# EasyEDA Pro project 25集创赛海云捷讯杯.epro, board PCB1_1
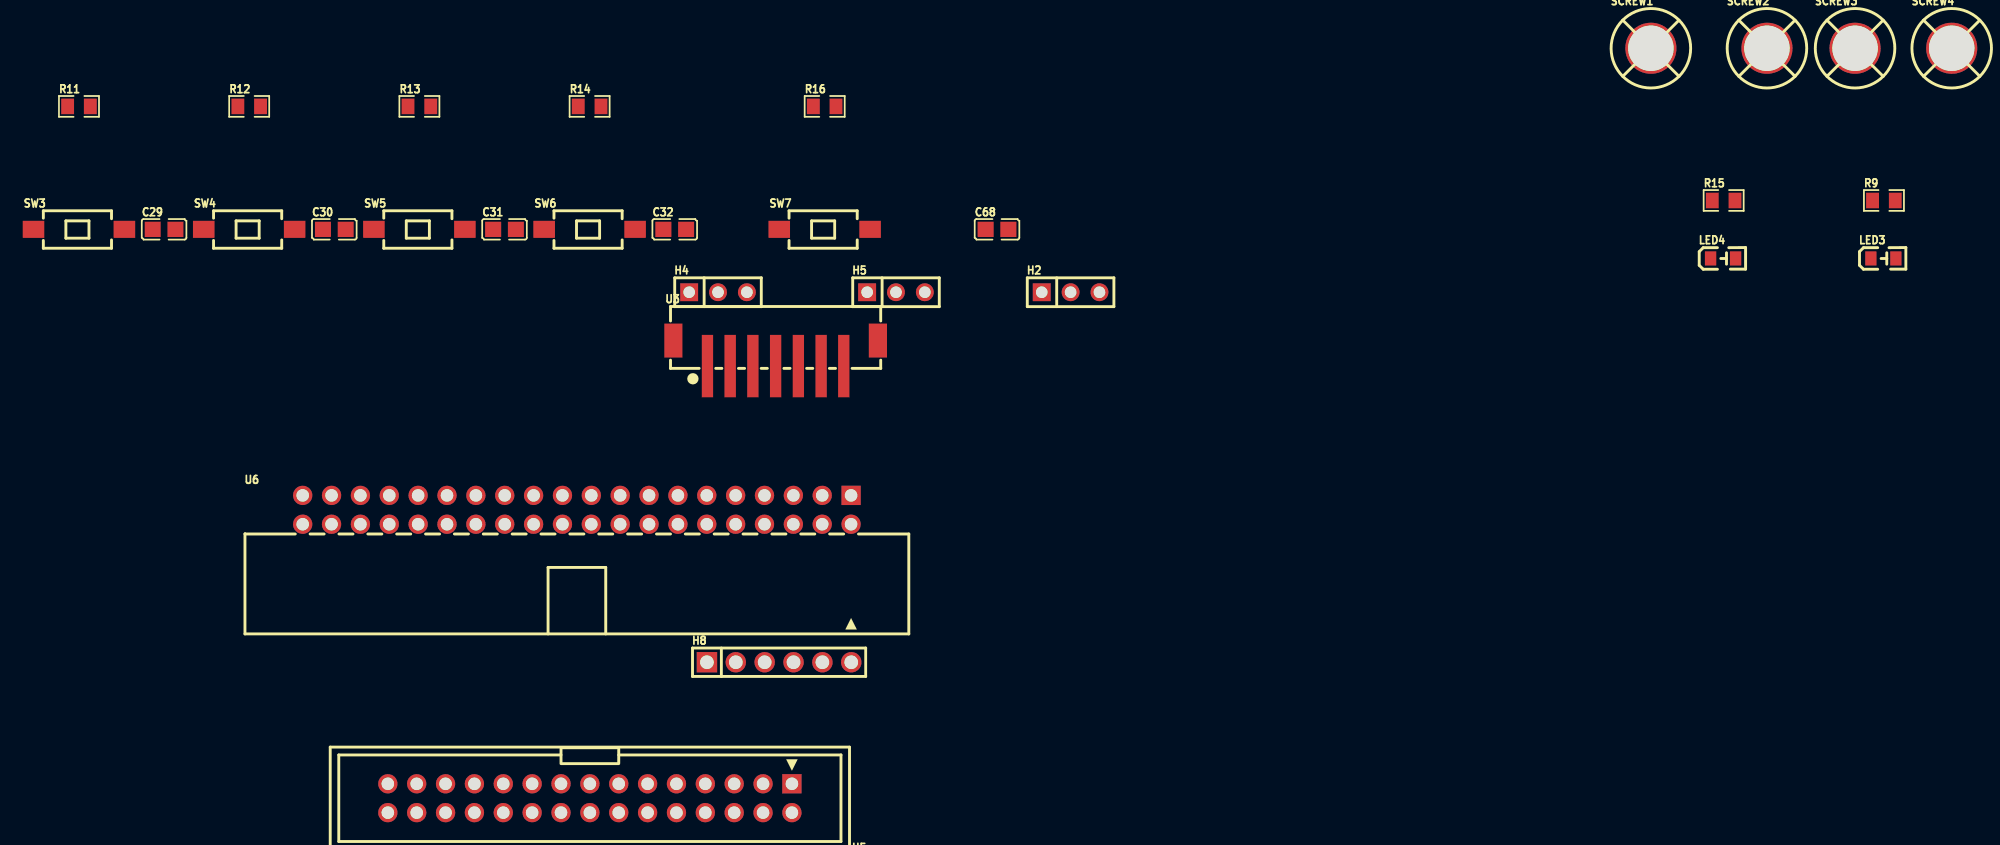
[diagram p10: board, top side]
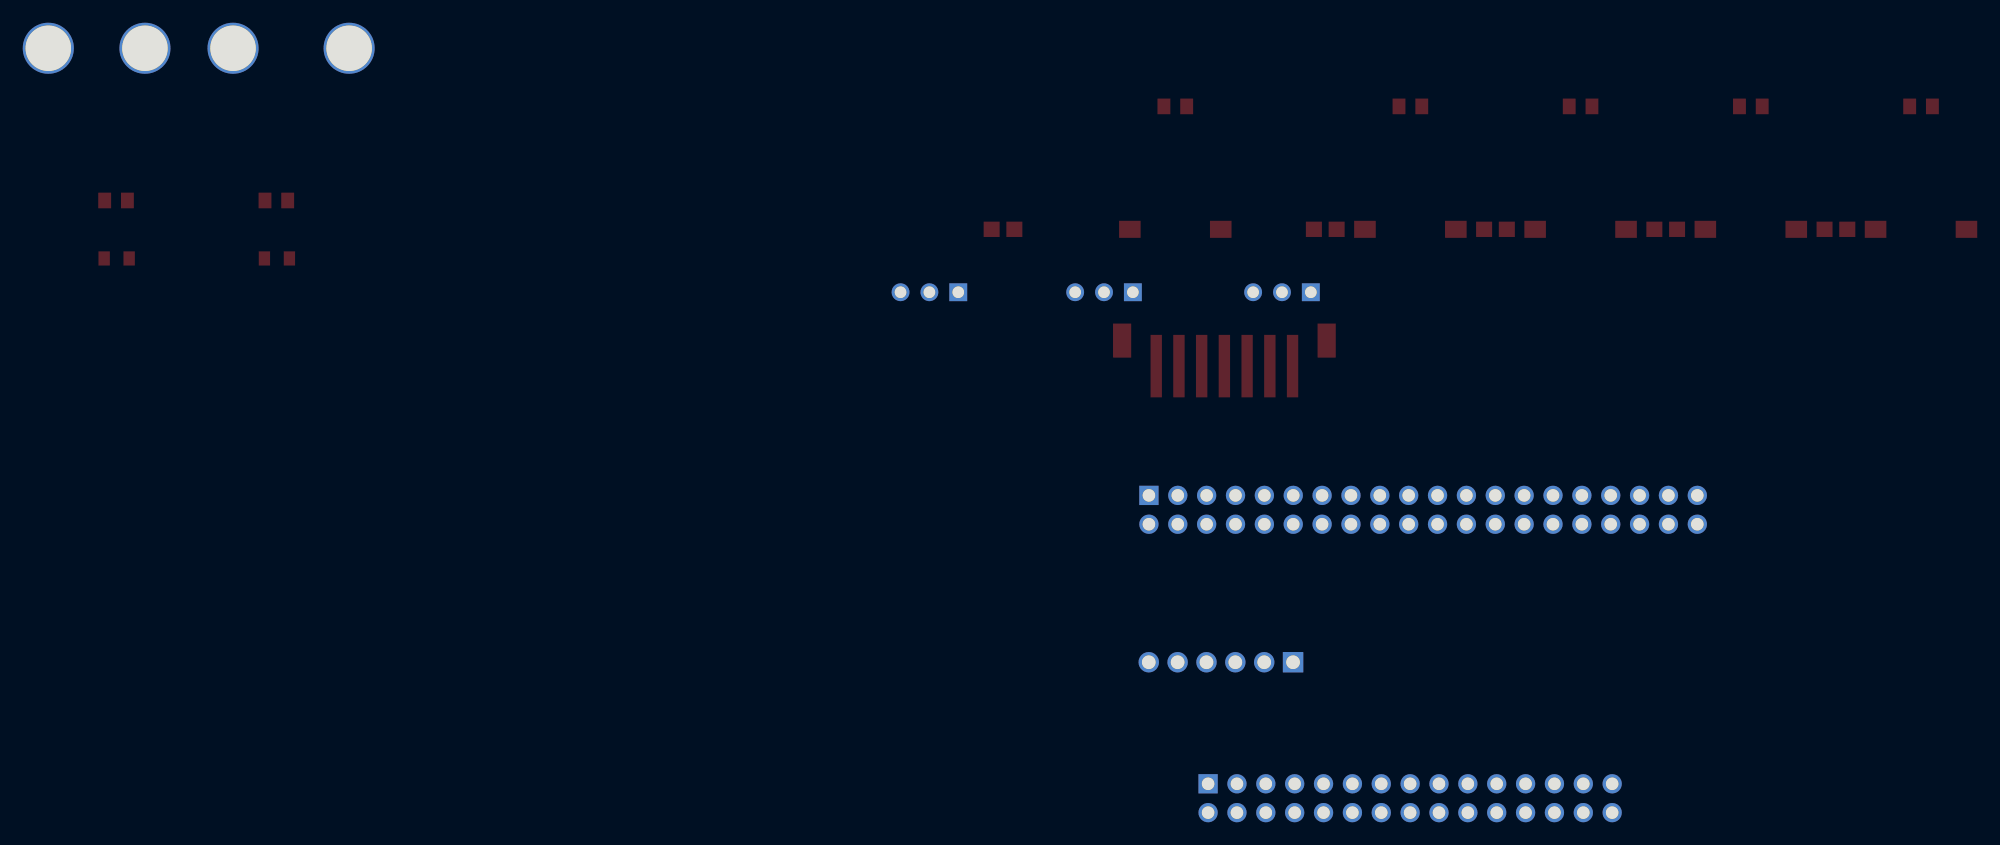
[diagram p11: board, bottom side, seen from below]

No outline. copper layers: Top Layer, Bottom Layer. Coordinates in mm from the lowest, leftmost part position.
Stack: Top Layer 0.035mm / Dielectric1 1.51mm FR4 er 4.5 / Bottom Layer 0.035mm

## Design rules (mm)
spacing copperThickness1oz (default): track to track 0.102, other pairs 0.152 to 0.3
spacing copperThickness2oz: track to track 0.203, other pairs 0.152 to 0.3
spacing Plane_innerPlane: track to track 0.102, other pairs 0.152 to 0.3
spacing Copper_copperRegion: track to track 0.102, other pairs 0.152 to 0.3
track width copperThickness1oz (default): min 0.127, default 0.254, max 2.54
track width copperThickness2oz: min 0.203, default 0.254, max 2.54
differential pair differentialPair (default): width min 0.127, default 0.254, max 2.54; gap min 0.152, default 0.152

## Placement (name value [footprint] x y rotation side)
C29  104  [c0805]  7.49 50.1 0 top
C30  104  [c0805]  22.47 50.1 0 top
C31  104  [c0805]  37.45 50.1 0 top
C32  104  [c0805]  52.43 50.1 0 top
C68  104  [c0805]  80.79 50.1 0 top
H2  -  [HDR-TH_3P-P2.54-V-F]  87.27 44.56 0 top
H4  -  [HDR-TH_3P-P2.54-V-F]  56.24 44.56 0 top
H5  -  [HDR-TH_3P-P2.54-V-F]  71.9 44.56 0 top
H8  -  [HDR-TH_6P-P2.54-V-M-1]  61.61 11.98 0 top
LED3  -  [LED_0805]  158.84 47.53 0 top
LED4  -  [LED_0805]  144.74 47.53 0 top
R9  10K  [R0805]  158.84 52.64 0 top
R11  10K  [R0805]  0 60.93 0 top
R12  10K  [R0805]  14.98 60.93 0 top
R13  10K  [R0805]  29.96 60.93 0 top
R14  10K  [R0805]  44.94 60.93 0 top
R15  10K  [R0805]  144.74 52.64 0 top
R16  10K  [R0805]  65.63 60.93 0 top
SCREW1  -  [M4螺丝]  138.33 66.05 0 top
SCREW2  -  [M4螺丝]  148.55 66.05 0 top
SCREW3  -  [M4螺丝]  156.3 66.05 0 top
SCREW4  -  [M4螺丝]  164.81 66.05 0 top
SW3  TS-1101-C-W  [SW-SMD_L6.0-W3.3-LS8.0]  0 50.1 0 top
SW4  TS-1101-C-W  [SW-SMD_L6.0-W3.3-LS8.0]  14.98 50.1 0 top
SW5  TS-1101-C-W  [SW-SMD_L6.0-W3.3-LS8.0]  29.96 50.1 0 top
SW6  TS-1101-C-W  [SW-SMD_L6.0-W3.3-LS8.0]  44.94 50.1 0 top
SW7  TS-1101-C-W  [SW-SMD_L6.0-W3.3-LS8.0]  65.63 50.1 0 top
U3  BX-PH2.0-7PLT  [CONN-SMD_7P-P2.00_WAFER-200L-7P]  61.31 39.18 0 top
U5  XDFH-0254-2*15P  [CONN-TH_30P-P2.54_LX_XDFH-0254-2X15P]  44.96 0 180 top
U6  XDFH-0259-2*20P  [CONN-TH_40P-P2.54_LX_XDFH-0259-2X20P]  43.82 25.4 0 top

## Footprints (pads in the part's own frame, mm; a bottom-side part is the same pattern mirrored in y, then rotated)
c0805
  rect 1.41x1.35 smd: 1(-1,0) 2(1,0)
CONN-SMD_7P-P2.00_WAFER-200L-7P
  rect 1x5.5 smd: 1(-6,-1.125) 2(-4,-1.125) 3(-2,-1.125) 4(0,-1.125) 5(2,-1.125) 6(4,-1.125) 7(6,-1.125)
  rect 1.6x3 smd: 8(-9,1.125) 9(9,1.125)
CONN-TH_30P-P2.54_LX_XDFH-0254-2X15P
  rect 1.7x1.7 hole 1.1: 1(-17.78,-1.27)
  round 1.7 hole 1.1: 2(-17.78,1.27) 3(-15.24,-1.27) 4(-15.24,1.27) 5(-12.7,-1.27) 6(-12.7,1.27) 7(-10.16,-1.27) 8(-10.16,1.27) 9(-7.62,-1.27) 10(-7.62,1.27) 11(-5.08,-1.27) 12(-5.08,1.27) 13(-2.54,-1.27) 14(-2.54,1.27) 15(0,-1.27) 16(0,1.27) 17(2.54,-1.27) 18(2.54,1.27) 19(5.08,-1.27) 20(5.08,1.27) 21(7.62,-1.27) 22(7.62,1.27) 23(10.16,-1.27) 24(10.16,1.27) 25(12.7,-1.27) 26(12.7,1.27) 27(15.24,-1.27) 28(15.24,1.27) 29(17.78,-1.27) 30(17.78,1.27)
CONN-TH_40P-P2.54_LX_XDFH-0259-2X20P
  rect 1.7x1.7 hole 1.1: 1(24.13,1.27)
  round 1.7 hole 1.1: 2(24.13,-1.27) 3(21.59,1.27) 4(21.59,-1.27) 5(19.05,1.27) 6(19.05,-1.27) 7(16.51,1.27) 8(16.51,-1.27) 9(13.97,1.27) 10(13.97,-1.27) 11(11.43,1.27) 12(11.43,-1.27) 13(8.89,1.27) 14(8.89,-1.27) 15(6.35,1.27) 16(6.35,-1.27) 17(3.81,1.27) 18(3.81,-1.27) 19(1.27,1.27) 20(1.27,-1.27) 21(-1.27,1.27) 22(-1.27,-1.27) 23(-3.81,1.27) 24(-3.81,-1.27) 25(-6.35,1.27) 26(-6.35,-1.27) 27(-8.89,1.27) 28(-8.89,-1.27) 29(-11.43,1.27) 30(-11.43,-1.27) 31(-13.97,1.27) 32(-13.97,-1.27) 33(-16.51,1.27) 34(-16.51,-1.27) 35(-19.05,1.27) 36(-19.05,-1.27) 37(-21.59,1.27) 38(-21.59,-1.27) 39(-24.13,1.27) 40(-24.13,-1.27)
HDR-TH_3P-P2.54-V-F
  rect 1.575x1.575 hole 1.02: 1(-2.54,0)
  round 1.575 hole 1.02: 2(0,0) 3(2.54,0)
HDR-TH_6P-P2.54-V-M-1
  rect 1.8x1.8 hole 1.2: 1(-6.35,0)
  round 1.8 hole 1.2: 2(-3.81,0) 3(-1.27,0) 4(1.27,0) 5(3.81,0) 6(6.35,0)
LED_0805
  rect 1x1.25 smd: 1(-1.15,0.005) 2(1.05,0.005)
M4螺丝
  round 4.5 hole 4: 1(0,0)
R0805
  rect 1.133x1.377 smd: 1(-1,0) 2(1,0)
SW-SMD_L6.0-W3.3-LS8.0
  rect 1.9x1.5 smd: 1(-4,0) 2(4,0)

## Nets
As in the schematic, except:
E8: U3.6 U6.5
F9: U3.5 U6.7

Pads without a net: SCREW1 1; SCREW2 1; SCREW3 1; SCREW4 1; U3 8 9
